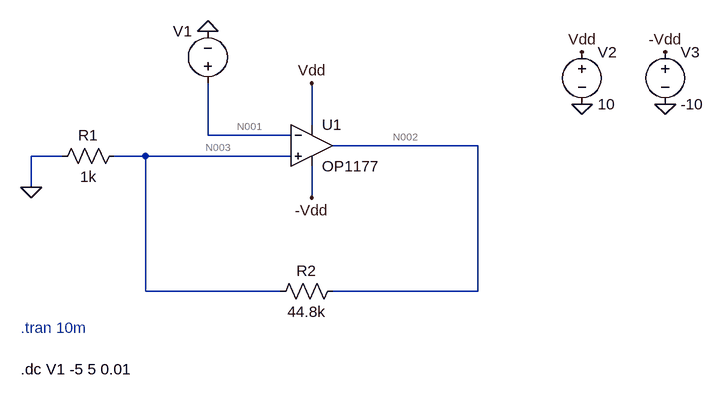
[diagram p0: schematic Draft3.asc]
Draft3.asc, the LTspice schematic file:
Version 4.1
SHEET 1 880 680
WIRE 192 112 192 48
WIRE 32 128 32 48
WIRE 160 128 32 128
WIRE 448 144 224 144
WIRE -192 160 -240 160
WIRE -64 160 -112 160
WIRE 160 160 -64 160
WIRE -240 208 -240 160
WIRE 192 224 192 176
WIRE -64 368 -64 160
WIRE 144 368 -64 368
WIRE 448 368 448 144
WIRE 448 368 224 368
FLAG 608 80 0
FLAG 736 80 0
FLAG 608 0 Vdd
FLAG 736 0 -Vdd
FLAG 32 -32 0
FLAG -240 208 0
FLAG 192 48 Vdd
FLAG 192 224 -Vdd
SYMBOL voltage 608 -16 R0
SYMATTR InstName V2
SYMATTR Value 10
SYMBOL voltage 736 -16 R0
WINDOW 123 0 0 Left 0
WINDOW 39 0 0 Left 0
SYMATTR InstName V3
SYMATTR Value -10
SYMBOL res -96 144 R90
WINDOW 0 0 56 VBottom 2
WINDOW 3 32 56 VTop 2
SYMATTR InstName R1
SYMATTR Value 1k
SYMBOL res 240 352 R90
WINDOW 0 0 56 VBottom 2
WINDOW 3 32 56 VTop 2
SYMATTR InstName R2
SYMATTR Value 44.8k
SYMBOL voltage 32 64 R180
WINDOW 0 24 96 Left 2
WINDOW 3 24 16 Left 2
WINDOW 123 0 0 Left 0
WINDOW 39 0 0 Left 0
SYMATTR InstName V1
SYMATTR Value ""
SYMBOL OpAmps\\OP1177 192 80 R0
SYMATTR InstName U1
TEXT -256 424 Left 2 ;.tran 10m
TEXT -256 488 Left 2 !.dc V1 -5 5 0.01

The netlist it stands for:
* Draft3.asc
V2 Vdd 0 10
V3 -Vdd 0 -10
R1 N003 0 1k
R2 N002 N003 44.8k
V1 N001 0
X§U1 N003 N001 Vdd -Vdd N002 OP1177  ; pins In+ In- V+ V- OUT
* .tran 10m
.dc V1 -5 5 0.01
.lib ADI1.lib
.backanno
.end

* Results of the author's LTspice run, read from the files saved beside the schematic
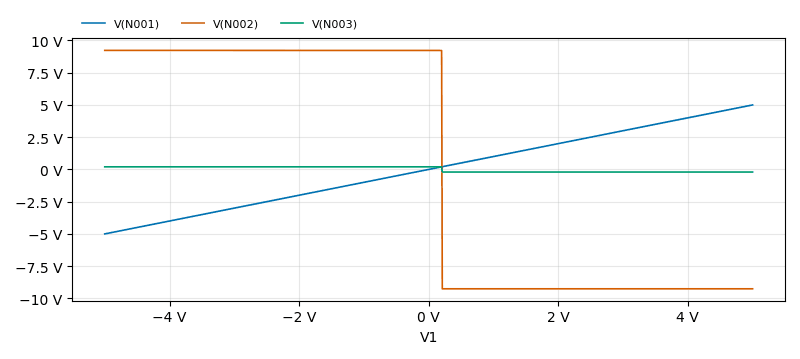
[diagram p1: DC transfer characteristic of Draft3.asc, plotted from the saved traces]
* DC transfer characteristic, 1 run:
*   V(N001): -5 V at V1=-5 V, 5 V at V1=5 V, min -5 V, max 5 V
*   V(N002): 9.232 V at V1=-5 V, -9.256 V at V1=5 V, min -9.256 V, max 9.232 V
*   V(N003): 201.6 mV at V1=-5 V, -202.1 mV at V1=5 V, min -202.1 mV, max 201.6 mV